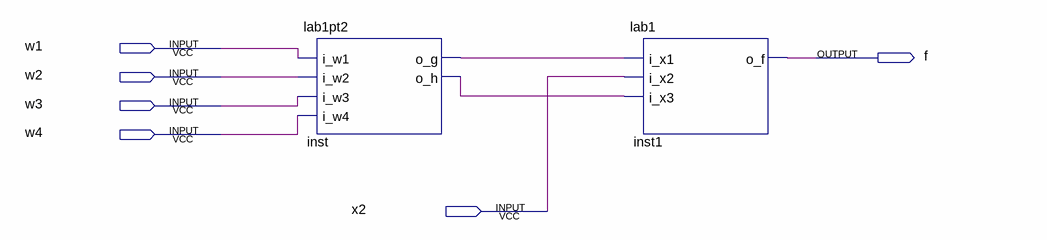
[diagram p0: schematic sheet]
// Quartus schematic lab1block.bdf as structural Verilog: 2 symbols, 6 pins
module lab1block (
  input  w1,
  input  w2,
  input  w3,
  input  w4,
  input  x2,
  output f
);

  wire inst_o_g, inst_o_h;

  lab1pt2 inst (.i_w1(w1), .i_w2(w2), .i_w3(w3), .i_w4(w4), .o_g(inst_o_g), .o_h(inst_o_h));
  lab1 inst1 (.i_x1(inst_o_g), .i_x2(x2), .i_x3(inst_o_h), .o_f(f));
endmodule
